# EAGLE design DOT-simple-SHIM (EAGLE 9.6.2)
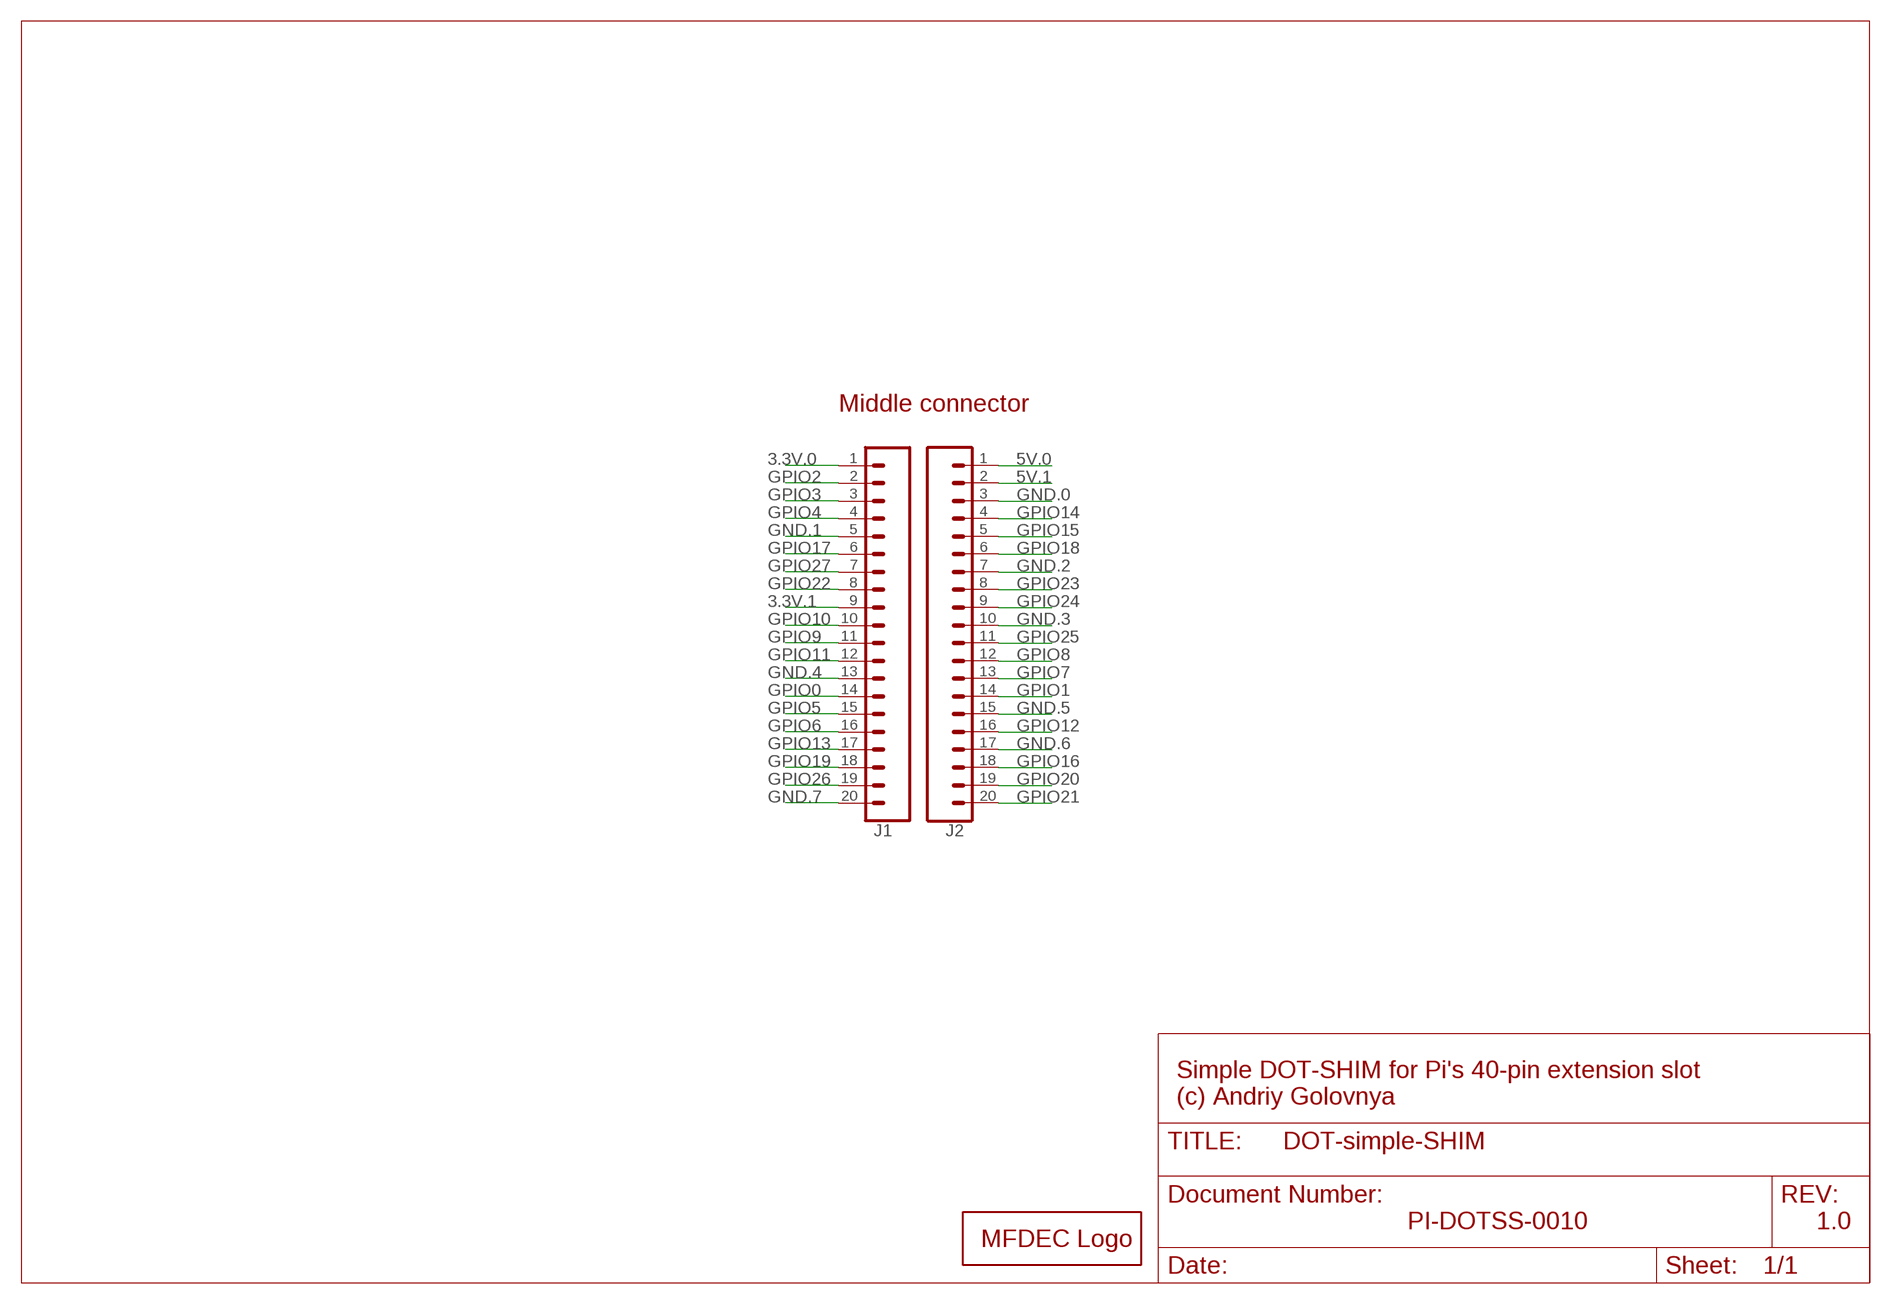
[diagram p0: schematic, sheet 1]

## Parts
J1  CONN_20LOCK  [1X20_LOCK]
J2  CONN_20LOCK  [1X20_LOCK]
LOGO2  MFDECLOGO_L_20MM  [MFDEC_L_20MM]

## Nets
3.3V.0: J1.1
3.3V.1: J1.9
5V.0: J2.1
5V.1: J2.2
GND.0: J2.3
GND.1: J1.5
GND.2: J2.7
GND.3: J2.10
GND.4: J1.13
GND.5: J2.15
GND.6: J2.17
GND.7: J1.20
GPIO0: J1.14
GPIO1: J2.14
GPIO2: J1.2
GPIO3: J1.3
GPIO4: J1.4
GPIO5: J1.15
GPIO6: J1.16
GPIO7: J2.13
GPIO8: J2.12
GPIO9: J1.11
GPIO10: J1.10
GPIO11: J1.12
GPIO12: J2.16
GPIO13: J1.17
GPIO14: J2.4
GPIO15: J2.5
GPIO16: J2.18
GPIO17: J1.6
GPIO18: J2.6
GPIO19: J1.18
GPIO20: J2.19
GPIO21: J2.20
GPIO22: J1.8
GPIO23: J2.8
GPIO24: J2.9
GPIO25: J2.11
GPIO26: J1.19
GPIO27: J1.7

## Notes on the sheet
- Middle connector
- Simple DOT-SHIM for Pi's 40-pin extension slot
  (c) Andriy Golovnya
- PI-DOTSS-0010 | 1.0

## Library data of the parts
J1 J2 = _my_locked_connectors:CONN_20: Multi connection point. Often used as Generic Header-pin footprint for 0.1 inch spaced/style header connections On any of the 0.1 inch spaced packages, you can populate with these: Break Away Headers - Straight <https://www.sparkfun.com/products/116> (PRT-00116) Break Away Male Headers - Right Angle <https://www.sparkfun.com/products/553> (PRT-00553) Female Headers <https://www.sparkfun.com/products/115> (PRT-00115) Break Away Headers - Machine Pin <https://www.sparkfun.com/products/117> (PRT-00117) Break Away Female Headers - Swiss Machine Pin <https://www.sparkfun.com/products/743> (PRT-00743) For SCREWTERMINALS and SPRING TERMINALS visit here: Screw Terimnals on SparkFun.com <https://www.sparkfun.com/search/results?term=Screw+Terminals> (5mm/3.5mm/2.54mm spacing) This device is also useful as a general connection point to wire up your design to another part of your project. Our various solder wires solder well into these plated through hole pads. Hook-Up Wire - Assortment (Stranded, 22 AWG) <https://www.sparkfun.com/products/11375> (PRT-11375) Hook-Up Wire - Assortment (Solid Core, 22 AWG) <https://www.sparkfun.com/products/11367> (PRT-11367) View the entire wire category on our website here <https://www.sparkfun.com/categories/141> Special notes: Molex polarized connector foot print use with SKU : PRT-08231 with associated crimp pins and housings. 1MM SMD Version SKU: PRT-10208 NOTES ON THE VARIANTS LOCK and LOCK_LONGPADS... This footprint was designed to help hold the alignment of a through-hole component (i.e. 6-pin header) while soldering it into place. You may notice that each hole has been shifted either up or down by 0.005 of an inch from it's more standard position (which is a perfectly straight line). This slight alteration caused the pins (the squares in the middle) to touch the edges of the holes. Because they are alternating, it causes a "brace" to hold the component in place. 0.005 has proven to be the perfect amount of "off-center" position when using our standard breakaway headers. Although looks a little odd when you look at the bare footprint, once you have a header in there, the alteration is very hard to notice. Also,if you push a header all the way into place, it is covered up entirely on the bottom side. Note about LOCK SPECIAL package: This is just like the LOCK variant in that the holes are staggared by 5 mil, but except for the last two holes. They are not altered from the "standard" footprint layout. This is used for a special purpose on the layout of our Graphic LCD Backpack. Make sure you want to use this device before selecting it for you project!
LOGO2 = _my_logos:MFDECLOGO: Midnight Fog - Digital Eye Candy LOGO

## Board
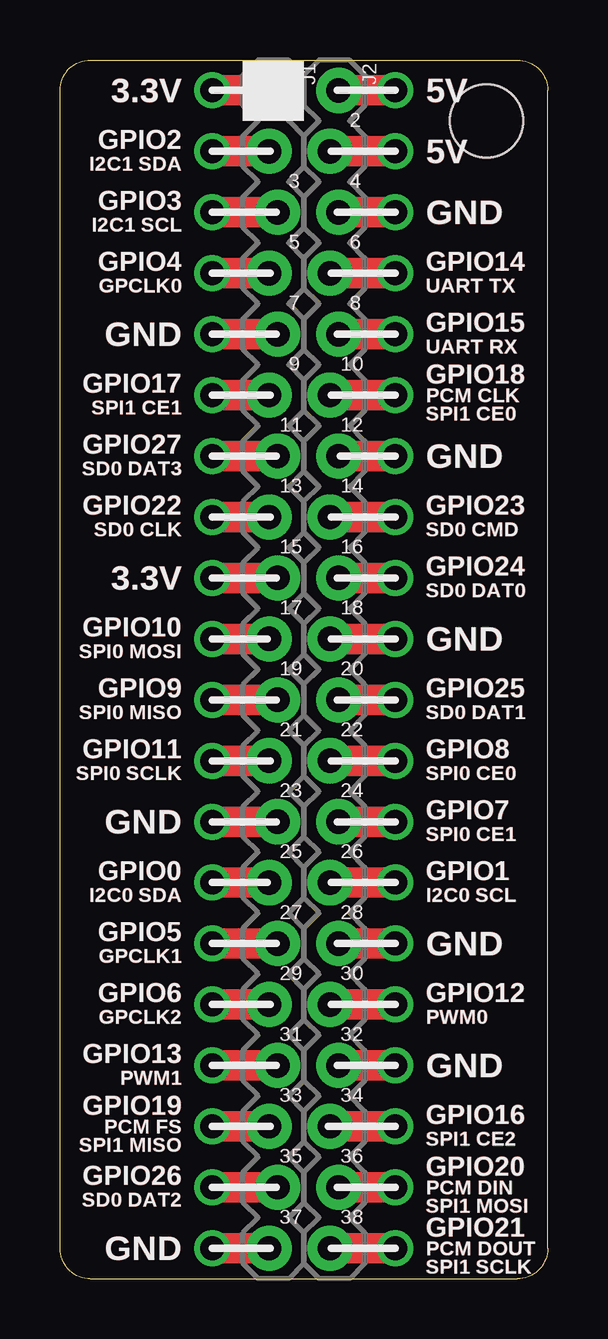
[diagram p1: board, top side]
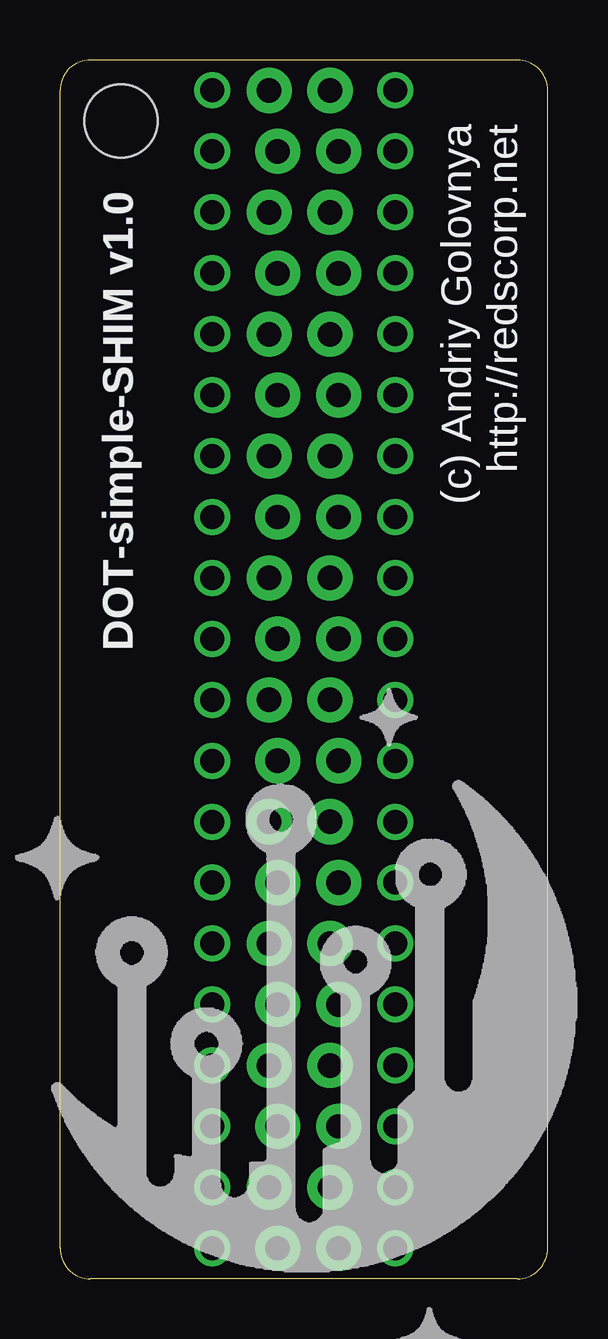
[diagram p2: board, bottom side, seen from below]

Size 20.32 x 50.8 mm. Coordinates in mm from the lower left corner, seen from the top.
Outline: 1.27,0 19.05,0 arc90 20.32,1.27 20.32,49.53 arc90 19.05,50.8 1.27,50.8 arc90 0,49.53 0,1.27 arc90 1.27,0
Copper layers (1*16): Top 0.035mm / dielectric 1.5mm / Bottom 0.035mm
Design rules "default *": minimum track width 6mil, minimum drill 0.35mm, track to track 6mil, track to pad 6mil, pad to pad 6mil, via to via 6mil, smd to smd 6mil, copper to edge 6mil, drill to drill 6mil, minimum pad ring 10mil, minimum via ring 8mil, stop-mask expansion 4mil, vias tented up to drill 20mil, thermal gap 10mil
Holes 3.05 mm at 17.78,48.26

### Footprints (pad centres in the part's own frame; a part is rotated, then mirrored left to right if it is on the bottom)
1X20_LOCK = drill 1.016 pad 1.88: 1 0,0.178; 2 2.54,-0.178; 3 5.08,0.178; 4 7.62,-0.178; 5 10.16,0.178; 6 12.7,-0.178; 7 15.24,0.178; 8 17.78,-0.178; 9 20.32,0.178; 10 22.86,-0.178; 11 25.4,0.178; 12 27.94,-0.178; 13 30.48,0.178; 14 33.02,-0.178; 15 35.56,0.178; 16 38.1,-0.178; 17 40.64,0.178; 18 43.18,-0.178; 19 45.72,0.178; 20 48.26,-0.178

### Placement (x,y rotation side)
J1  8.89,49.53 270 top
J2  11.43,49.53 270 top
LOGO2  -3.05,-5.59 90 bottom  (outside the outline)

### Tracks (layer width: path | path; a pad name or v marks a point on that pad's centre or on a via)
3.3V.0  (via drill 1)
  Top 1.27: v6.35,49.53 J1.1
3.3V.1  (via drill 1)
  Top 1.27: v6.35,29.21 J1.9
5V.0  (via drill 1)
  Top 1.27: J2.1 v13.97,49.53
5V.1  (via drill 1)
  Top 1.27: J2.2 v13.97,46.99
GND.0  (via drill 1)
  Top 1.27: J2.3 v13.97,44.45
GND.1  (via drill 1)
  Top 1.27: v6.35,39.37 J1.5
GND.2  (via drill 1)
  Top 1.27: J2.7 v13.97,34.29
GND.3  (via drill 1)
  Top 1.27: v13.97,26.67 J2.10
GND.4  (via drill 1)
  Top 1.27: v6.35,19.05 J1.13
GND.5  (via drill 1)
  Top 1.27: J2.15 v13.97,13.97
GND.6  (via drill 1)
  Top 1.27: v13.97,8.89 J2.17
GND.7  (via drill 1)
  Top 1.27: v6.35,1.27 J1.20
GPIO0  (via drill 1)
  Top 1.27: v6.35,16.51 J1.14
GPIO1  (via drill 1)
  Top 1.27: J2.14 v13.97,16.51
GPIO2  (via drill 1)
  Top 1.27: v6.35,46.99 J1.2
GPIO3  (via drill 1)
  Top 1.27: v6.35,44.45 J1.3
GPIO4  (via drill 1)
  Top 1.27: v6.35,41.91 J1.4
GPIO5  (via drill 1)
  Top 1.27: v6.35,13.97 J1.15
GPIO6  (via drill 1)
  Top 1.27: v6.35,11.43 J1.16
GPIO7  (via drill 1)
  Top 1.27: v13.97,19.05 J2.13
GPIO8  (via drill 1)
  Top 1.27: J2.12 v13.97,21.59
GPIO9  (via drill 1)
  Top 1.27: v6.35,24.13 J1.11
GPIO10  (via drill 1)
  Top 1.27: v6.35,26.67 J1.10
GPIO11  (via drill 1)
  Top 1.27: v6.35,21.59 J1.12
GPIO12  (via drill 1)
  Top 1.27: v13.97,11.43 J2.16
GPIO13  (via drill 1)
  Top 1.27: v6.35,8.89 J1.17
GPIO14  (via drill 1)
  Top 1.27: J2.4 v13.97,41.91
GPIO15  (via drill 1)
  Top 1.27: J2.5 v13.97,39.37
GPIO16  (via drill 1)
  Top 1.27: v13.97,6.35 J2.18
GPIO17  (via drill 1)
  Top 1.27: v6.35,36.83 J1.6
GPIO18  (via drill 1)
  Top 1.27: v13.97,36.83 J2.6
GPIO19  (via drill 1)
  Top 1.27: v6.35,6.35 J1.18
GPIO20  (via drill 1)
  Top 1.27: v13.97,3.81 J2.19
GPIO21  (via drill 1)
  Top 1.27: J2.20 v13.97,1.27
GPIO22  (via drill 1)
  Top 1.27: v6.35,31.75 J1.8
GPIO23  (via drill 1)
  Top 1.27: J2.8 v13.97,31.75
GPIO24  (via drill 1)
  Top 1.27: J2.9 v13.97,29.21
GPIO25  (via drill 1)
  Top 1.27: v13.97,24.13 J2.11
GPIO26  (via drill 1)
  Top 1.27: v6.35,3.81 J1.19
GPIO27  (via drill 1)
  Top 1.27: v6.35,34.29 J1.7

### Text on the board
Top: 3.3V | 5V | GPIO2 | 5V | I2C1 SDA | GPIO3 | I2C1 SCL | GND | GPIO4 | GPIO14 | GPCLK0 | UART TX | GPIO15 | GND | UART RX | GPIO18 | GPIO17 | PCM CLK | SPI1 CE1 | SPI1 CE0 | GPIO27 | SD0 DAT3 | GND | GPIO22 | GPIO23 | SD0 CLK | SD0 CMD | GPIO24 | 3.3V | SD0 DAT0 | GPIO10 | GND | SPI0 MOSI | GPIO9 | GPIO25 | SPI0 MISO | SD0 DAT1 | GPIO11 | GPIO8 | SPI0 SCLK | SPI0 CE0 | GPIO7 | GND | SPI0 CE1 | GPIO0 | GPIO1 | I2C0 SDA | I2C0 SCL | GPIO5 | GND | GPCLK1 | GPIO6 | GPIO12 | GPCLK2 | PWM0 | GPIO13 | GND | PWM1 | GPIO19 | GPIO16 | PCM FS | SPI1 MISO | SPI1 CE2 | GPIO20 | GPIO26 | PCM DIN | SD0 DAT2 | SPI1 MOSI | GPIO21 | GND | PCM DOUT | SPI1 SCLK
Bottom: (c) Andriy Golovnya / http://redscorp.net | DOT-simple-SHIM v1.0
tPlace: 3.3V | 5V | 2 | GPIO2 | 5V | I2C1 SDA | GPIO3 | 3 | 4 | I2C1 SCL | GND | 5 | 6 | GPIO4 | GPIO14 | GPCLK0 | UART TX | 7 | 8 | GPIO15 | GND | UART RX | 9 | 10 | GPIO18 | GPIO17 | PCM CLK | SPI1 CE1 | SPI1 CE0 | GPIO27 | 11 | 12 | SD0 DAT3 | GND | 13 | 14 | GPIO22 | GPIO23 | SD0 CLK | SD0 CMD | 15 | 16 | GPIO24 | 3.3V | SD0 DAT0 | 17 | 18 | GPIO10 | GND | SPI0 MOSI | GPIO9 | 19 | 20 | GPIO25 | SPI0 MISO | SD0 DAT1 | 21 | 22 | GPIO11 | GPIO8 | SPI0 SCLK | SPI0 CE0 | 23 | 24 | GPIO7 | GND | SPI0 CE1 | 25 | 26 | GPIO0 | GPIO1 | I2C0 SDA | I2C0 SCL | 27 | 28 | GPIO5 | GND | GPCLK1 | GPIO6 | 29 | 30 | GPIO12 | GPCLK2 | PWM0 | 31 | 32 | GPIO13 | GND | PWM1 | GPIO19 | 33 | 34 | GPIO16 | PCM FS | SPI1 MISO | SPI1 CE2 | 35 | 36 | GPIO20 | GPIO26 | PCM DIN | SD0 DAT2 | SPI1 MOSI | 37 | 38 | GPIO21 | GND | PCM DOUT | SPI1 SCLK
bPlace: (c) Andriy Golovnya / http://redscorp.net | DOT-simple-SHIM v1.0